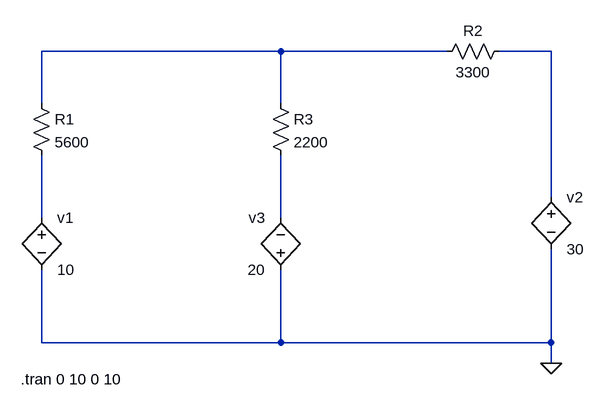
[diagram p0: schematic questão2.asc]
questão2.asc, the LTspice schematic file:
Version 4
SHEET 1 880 680
WIRE -32 -160 -400 -160
WIRE 224 -160 -32 -160
WIRE 384 -160 304 -160
WIRE -400 -80 -400 -160
WIRE -32 -80 -32 -160
WIRE 384 64 384 -160
WIRE -400 96 -400 0
WIRE -32 96 -32 0
WIRE -400 288 -400 176
WIRE -32 288 -32 176
WIRE -32 288 -400 288
WIRE 384 288 384 144
WIRE 384 288 -32 288
WIRE 384 320 384 288
FLAG 384 320 0
SYMBOL bv 384 48 R0
SYMATTR InstName v2
SYMATTR Value 30
SYMATTR Prefix v
SYMBOL res -416 -96 R0
SYMATTR InstName R1
SYMATTR Value 5600
SYMBOL res -48 -96 R0
SYMATTR InstName R3
SYMATTR Value 2200
SYMBOL res 320 -176 R90
WINDOW 0 0 56 VBottom 2
WINDOW 3 32 56 VTop 2
SYMATTR InstName R2
SYMATTR Value 3300
SYMBOL bv -32 192 R180
WINDOW 0 24 96 Left 2
WINDOW 3 24 16 Left 2
SYMATTR InstName v3
SYMATTR Value 20
SYMATTR Prefix v
SYMBOL bv -400 80 R0
SYMATTR InstName v1
SYMATTR Value 10
SYMATTR Prefix v
TEXT -432 344 Left 2 !.tran 0 10 0 10

The netlist it stands for:
* questão2.asc
v2 N002 0 30
R1 N001 N003 5600
R3 N001 N004 2200
R2 N002 N001 3300
v3 0 N004 20
v1 N003 0 10
.tran 0 10 0 10
.backanno
.end

* Results of the author's LTspice run, read from the files saved beside the schematic
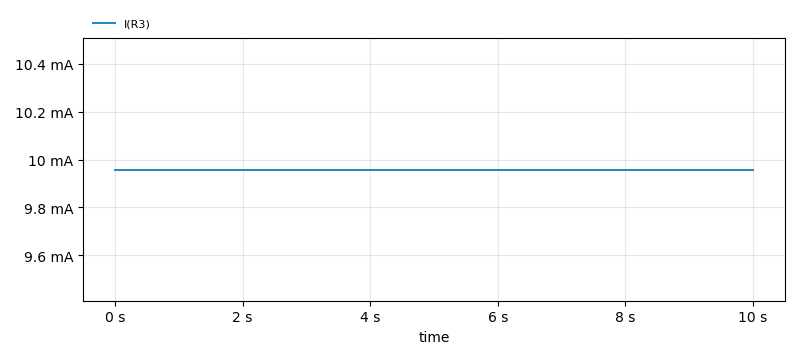
[diagram p1: Transient Analysis of questão2.asc, plotted from the saved traces]
* Transient Analysis, 1 run:
*   I(R3): min 9.958 mA, max 9.958 mA, average 9.958 mA, rms 9.958 mA, last 9.958 mA